# Altium schematic sheet функциональная_схема.SchDoc: Система динамического
size 420 x 297 mm; CheckedBy: Марченко; Author: Пенязьков; DocumentNumber: БГУИР.250504.019Э2; Scale: 1:1; Title2str: освещения; DocumentType: Схема электрическая функциональная; DecimalNumber: Децимальный номер; HeadOfSector: Нач. сектора; MainDevice: Перв.примен.; Name: Наименование; PageSetup: Record=PageOptions|CenterHorizontal=True|CenterVertical=True|PrintScale=0.70|XCorrection=1.00|YCorrection=1.00|PrintKind=1|BorderSize=5000000|LeftOffset=0|BottomOffset=0|Orientation=2|PaperLength=1000|PaperWidth=1000|Scale=100|PaperSource=7|PrintQuality=600|MediaType=1|DitherType=10|PrintScaleMode=1|PaperKind=A4|PaperIndex=9
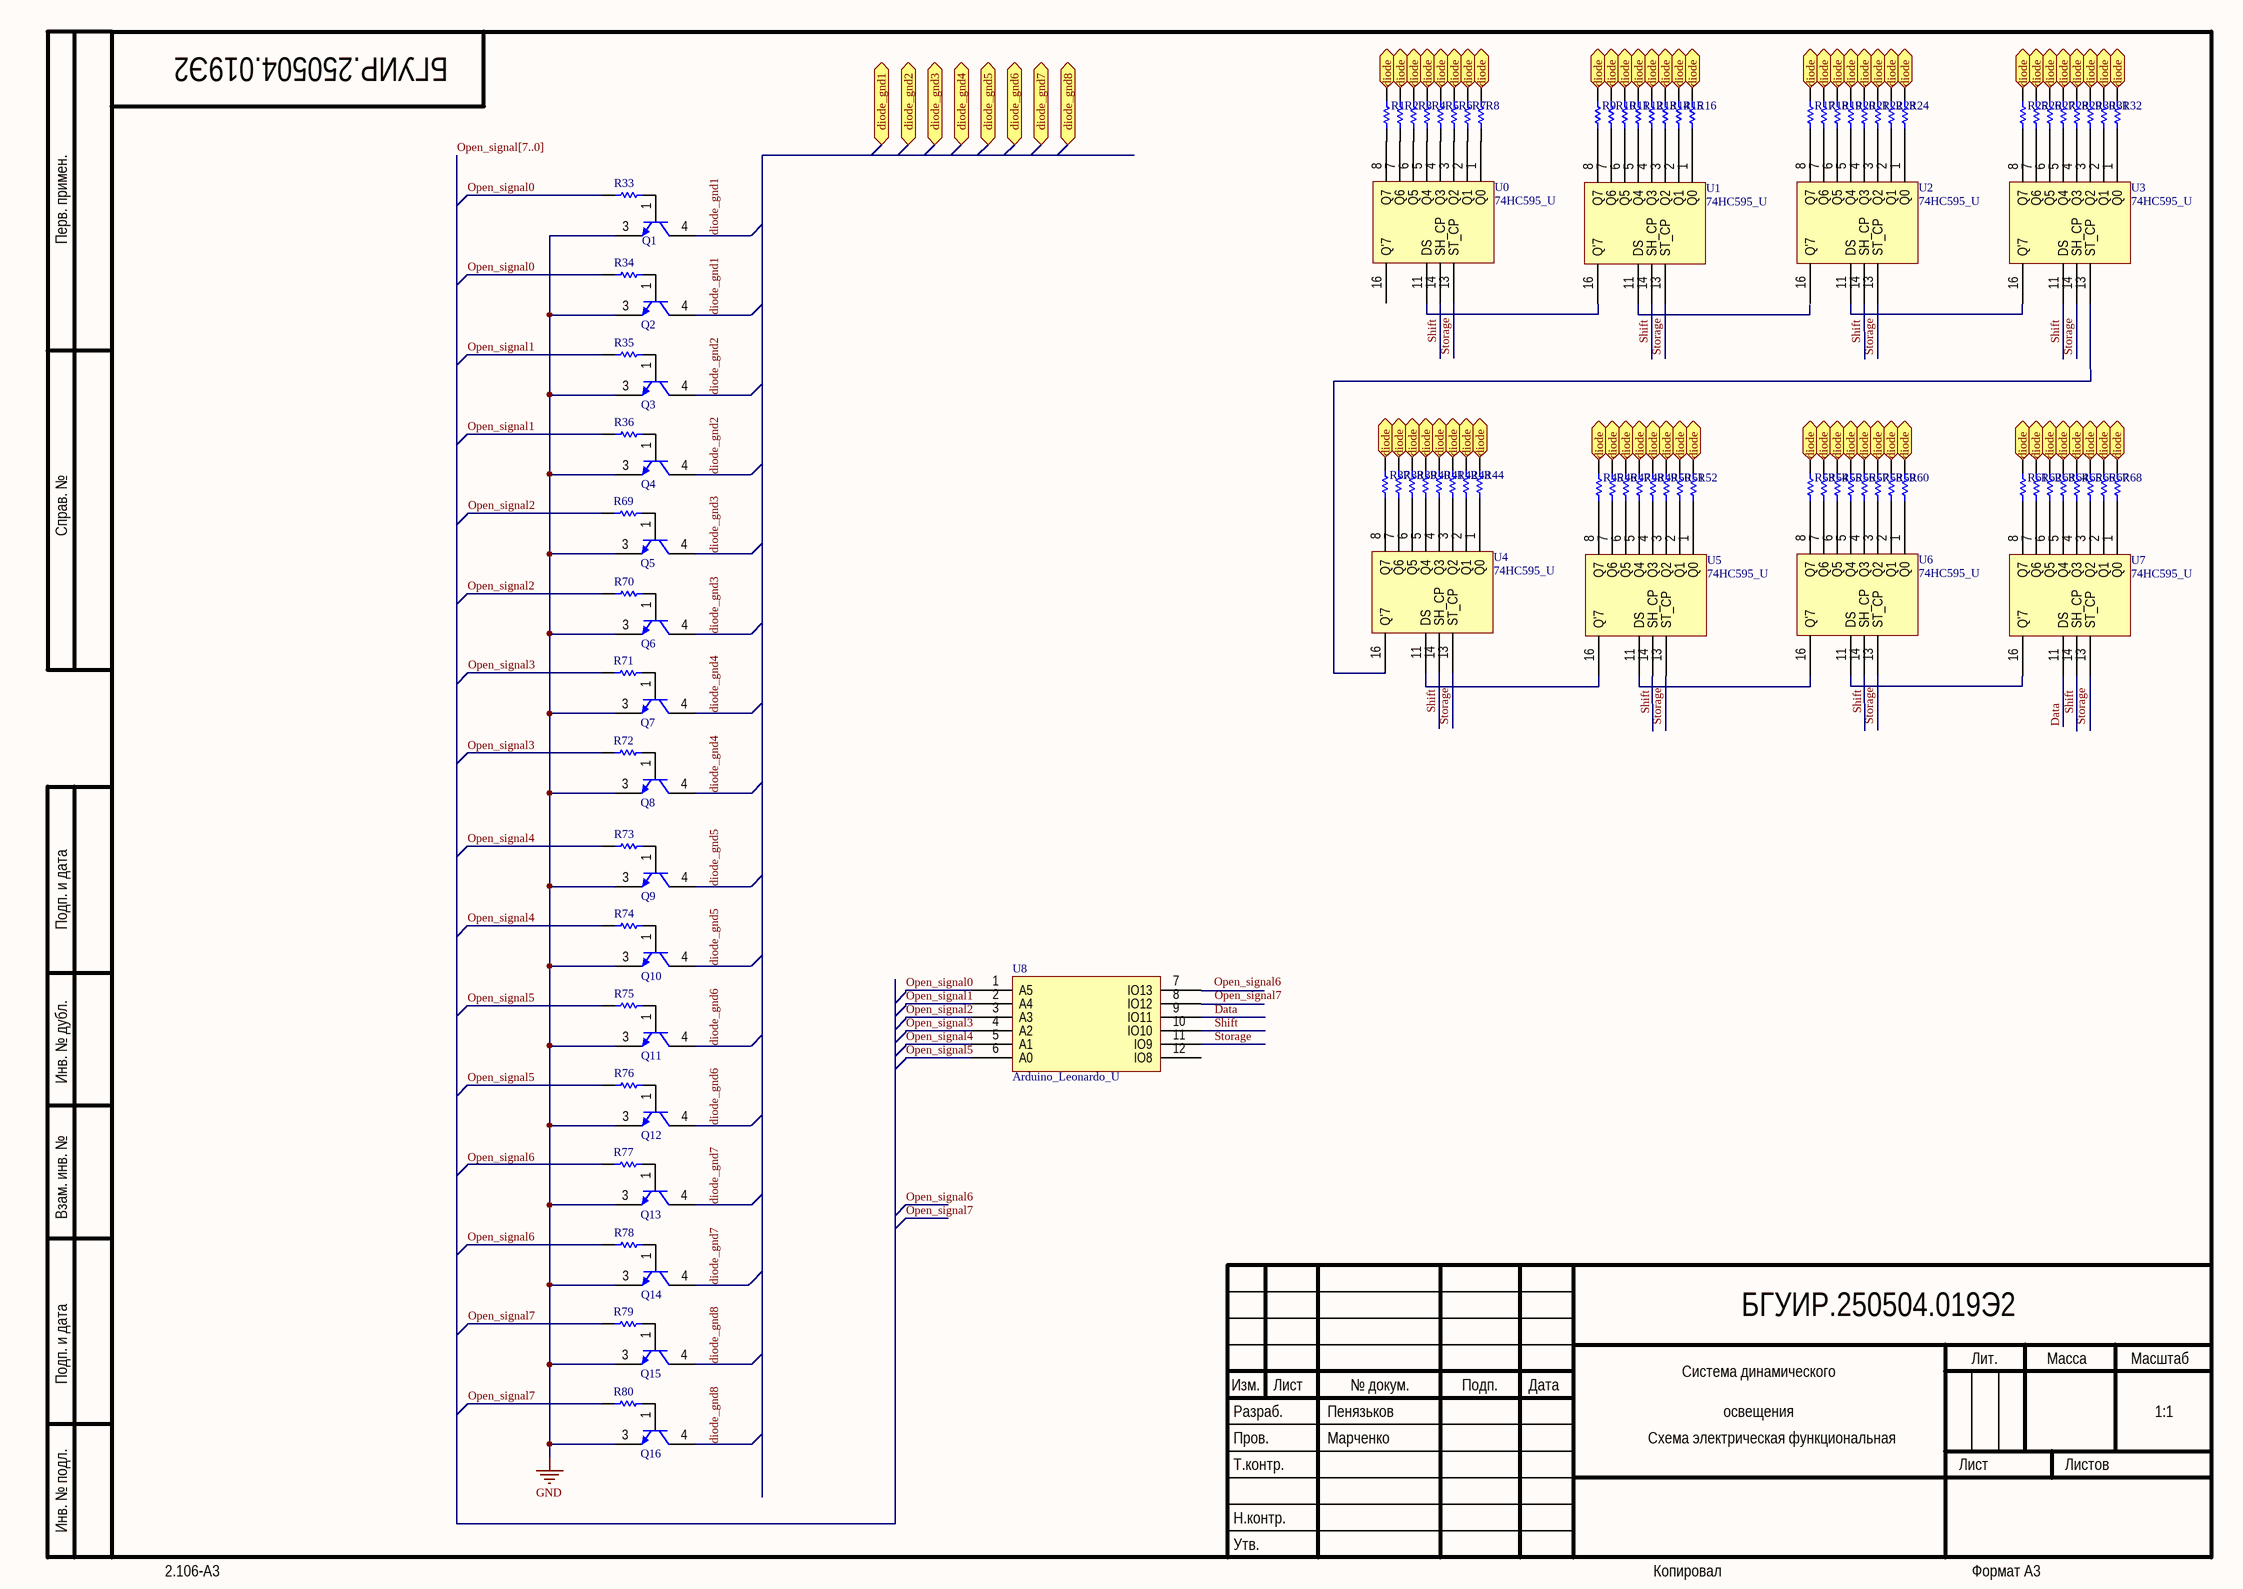
[diagram p0: функциональная_схема.SchDoc]

## Parts
Q1  (no value)  [ONSC-DPAK-3-369C-01_V]
Q2  (no value)  [ONSC-DPAK-3-369C-01_V]
Q3  (no value)  [ONSC-DPAK-3-369C-01_V]
Q4  (no value)  [ONSC-DPAK-3-369C-01_V]
Q5  (no value)  [ONSC-DPAK-3-369C-01_V]
Q6  (no value)  [ONSC-DPAK-3-369C-01_V]
Q7  (no value)  [ONSC-DPAK-3-369C-01_V]
Q8  (no value)  [ONSC-DPAK-3-369C-01_V]
Q9  (no value)  [ONSC-DPAK-3-369C-01_V]
Q10  (no value)  [ONSC-DPAK-3-369C-01_V]
Q11  (no value)  [ONSC-DPAK-3-369C-01_V]
Q12  (no value)  [ONSC-DPAK-3-369C-01_V]
Q13  (no value)  [ONSC-DPAK-3-369C-01_V]
Q14  (no value)  [ONSC-DPAK-3-369C-01_V]
Q15  (no value)  [ONSC-DPAK-3-369C-01_V]
Q16  (no value)  [ONSC-DPAK-3-369C-01_V]
R1  (no value)  [RESC1210(3225)_L]
R2  (no value)  [RESC1210(3225)_L]
R3  (no value)  [RESC1210(3225)_L]
R4  (no value)  [RESC1210(3225)_L]
R5  (no value)  [RESC1210(3225)_L]
R6  (no value)  [RESC1210(3225)_L]
R7  (no value)  [RESC1210(3225)_L]
R8  (no value)  [RESC1210(3225)_L]
R9  (no value)  [RESC1210(3225)_L]
R10  (no value)  [RESC1210(3225)_L]
R11  (no value)  [RESC1210(3225)_L]
R12  (no value)  [RESC1210(3225)_L]
R13  (no value)  [RESC1210(3225)_L]
R14  (no value)  [RESC1210(3225)_L]
R15  (no value)  [RESC1210(3225)_L]
R16  (no value)  [RESC1210(3225)_L]
R17  (no value)  [RESC1210(3225)_L]
R18  (no value)  [RESC1210(3225)_L]
R19  (no value)  [RESC1210(3225)_L]
R20  (no value)  [RESC1210(3225)_L]
R21  (no value)  [RESC1210(3225)_L]
R22  (no value)  [RESC1210(3225)_L]
R23  (no value)  [RESC1210(3225)_L]
R24  (no value)  [RESC1210(3225)_L]
R25  (no value)  [RESC1210(3225)_L]
R26  (no value)  [RESC1210(3225)_L]
R27  (no value)  [RESC1210(3225)_L]
R28  (no value)  [RESC1210(3225)_L]
R29  (no value)  [RESC1210(3225)_L]
R30  (no value)  [RESC1210(3225)_L]
R31  (no value)  [RESC1210(3225)_L]
R32  (no value)  [RESC1210(3225)_L]
R33  (no value)  [RESC1210(3225)_L]
R34  (no value)  [RESC1210(3225)_L]
R35  (no value)  [RESC1210(3225)_L]
R36  (no value)  [RESC1210(3225)_L]
R37  (no value)  [RESC1210(3225)_L]
R38  (no value)  [RESC1210(3225)_L]
R39  (no value)  [RESC1210(3225)_L]
R40  (no value)  [RESC1210(3225)_L]
R41  (no value)  [RESC1210(3225)_L]
R42  (no value)  [RESC1210(3225)_L]
R43  (no value)  [RESC1210(3225)_L]
R44  (no value)  [RESC1210(3225)_L]
R45  (no value)  [RESC1210(3225)_L]
R46  (no value)  [RESC1210(3225)_L]
R47  (no value)  [RESC1210(3225)_L]
R48  (no value)  [RESC1210(3225)_L]
R49  (no value)  [RESC1210(3225)_L]
R50  (no value)  [RESC1210(3225)_L]
R51  (no value)  [RESC1210(3225)_L]
R52  (no value)  [RESC1210(3225)_L]
R53  (no value)  [RESC1210(3225)_L]
R54  (no value)  [RESC1210(3225)_L]
R55  (no value)  [RESC1210(3225)_L]
R56  (no value)  [RESC1210(3225)_L]
R57  (no value)  [RESC1210(3225)_L]
R58  (no value)  [RESC1210(3225)_L]
R59  (no value)  [RESC1210(3225)_L]
R60  (no value)  [RESC1210(3225)_L]
R61  (no value)  [RESC1210(3225)_L]
R62  (no value)  [RESC1210(3225)_L]
R63  (no value)  [RESC1210(3225)_L]
R64  (no value)  [RESC1210(3225)_L]
R65  (no value)  [RESC1210(3225)_L]
R66  (no value)  [RESC1210(3225)_L]
R67  (no value)  [RESC1210(3225)_L]
R68  (no value)  [RESC1210(3225)_L]
R69  (no value)  [RESC1210(3225)_L]
R70  (no value)  [RESC1210(3225)_L]
R71  (no value)  [RESC1210(3225)_L]
R72  (no value)  [RESC1210(3225)_L]
R73  (no value)  [RESC1210(3225)_L]
R74  (no value)  [RESC1210(3225)_L]
R75  (no value)  [RESC1210(3225)_L]
R76  (no value)  [RESC1210(3225)_L]
R77  (no value)  [RESC1210(3225)_L]
R78  (no value)  [RESC1210(3225)_L]
R79  (no value)  [RESC1210(3225)_L]
R80  (no value)  [RESC1210(3225)_L]
U0  74HC595_U
U1  74HC595_U
U2  74HC595_U
U3  74HC595_U
U4  74HC595_U
U5  74HC595_U
U6  74HC595_U
U7  74HC595_U
U8  Arduino_Leonardo_U

## Ports
diode, diode_gnd1, diode_gnd2, diode_gnd3, diode_gnd4, diode_gnd5, diode_gnd6, diode_gnd7, diode_gnd8

## Nets
GND: Q1.3(E) Q2.3(E) Q3.3(E) Q4.3(E) Q5.3(E) Q6.3(E) Q7.3(E) Q8.3(E) Q9.3(E) Q10.3(E) Q11.3(E) Q12.3(E) Q13.3(E) Q14.3(E) Q15.3(E) Q16.3(E)
Data: U8.9(IO11)
diode: R1.2 R2.2 R3.2 R4.2 R5.2 R6.2 R7.2 R8.2 R9.2 R10.2 R11.2 R12.2 R13.2 R14.2 R15.2 R16.2 R17.2 R18.2 R19.2 R20.2 R21.2 R22.2 R23.2 R24.2 R25.2 R26.2 R27.2 R28.2 R29.2 R30.2 R31.2 R32.2 R37.2 R38.2 R39.2 R40.2 R41.2 R42.2 R43.2 R44.2 R45.2 R46.2 R47.2 R48.2 R49.2 R50.2 R51.2 R52.2 R53.2 R54.2 R55.2 R56.2 R57.2 R58.2 R59.2 R60.2 R61.2 R62.2 R63.2 R64.2 R65.2 R66.2 R67.2 R68.2 ; port diode
diode_gnd1: Q1.4(C) Q2.4(C)
diode_gnd2: Q3.4(C) Q4.4(C)
diode_gnd3: Q5.4(C) Q6.4(C)
diode_gnd4: Q7.4(C) Q8.4(C)
diode_gnd5: Q9.4(C) Q10.4(C)
diode_gnd6: Q11.4(C) Q12.4(C)
diode_gnd7: Q13.4(C) Q14.4(C)
diode_gnd8: Q15.4(C) Q16.4(C)
Open_signal0: R33.2 R34.2 U8.1(A5)
Open_signal1: R35.2 R36.2 U8.2(A4)
Open_signal2: R69.2 R70.2 U8.3(A3)
Open_signal3: R71.2 R72.2 U8.4(A2)
Open_signal4: R73.2 R74.2 U8.5(A1)
Open_signal5: R75.2 R76.2 U8.6(A0)
Open_signal6: R77.2 R78.2
Open_signal7: R79.2 R80.2
Shift: U0.14(SH_CP) U1.14(SH_CP) U3.11(DS) U4.14(SH_CP) U8.10(IO10)
Storage: U0.13(ST_CP) U1.13(ST_CP) U3.14(SH_CP) U4.13(ST_CP) U8.11(IO9)
NetQ1_1: Q1.1(B) R33.1
NetQ2_1: Q2.1(B) R34.1
NetQ3_1: Q3.1(B) R35.1
NetQ4_1: Q4.1(B) R36.1
NetQ5_1: Q5.1(B) R69.1
NetQ6_1: Q6.1(B) R70.1
NetQ7_1: Q7.1(B) R71.1
NetQ8_1: Q8.1(B) R72.1
NetQ9_1: Q9.1(B) R73.1
NetQ10_1: Q10.1(B) R74.1
NetQ11_1: Q11.1(B) R75.1
NetQ12_1: Q12.1(B) R76.1
NetQ13_1: Q13.1(B) R77.1
NetQ14_1: Q14.1(B) R78.1
NetQ15_1: Q15.1(B) R79.1
NetQ16_1: Q16.1(B) R80.1
NetR9_1: R9.1 U1.8(Q7)
NetR10_1: R10.1 U1.7(Q6)
NetR11_1: R11.1 U1.6(Q5)
NetR12_1: R12.1 U1.5(Q4)
NetR13_1: R13.1 U1.4(Q3)
NetR14_1: R14.1 U1.3(Q2)
NetR15_1: R15.1 U1.2(Q1)
NetR16_1: R16.1 U1.1(Q0)
NetR17_1: R17.1 U2.8(Q7)
NetR18_1: R18.1 U2.7(Q6)
NetR19_1: R19.1 U2.6(Q5)
NetR20_1: R20.1 U2.5(Q4)
NetR21_1: R21.1 U2.4(Q3)
NetR22_1: R22.1 U2.3(Q2)
NetR23_1: R23.1 U2.2(Q1)
NetR24_1: R24.1 U2.1(Q0)
NetR25_1: R25.1 U3.8(Q7)
NetR26_1: R26.1 U3.7(Q6)
NetR27_1: R27.1 U3.6(Q5)
NetR28_1: R28.1 U3.5(Q4)
NetR29_1: R29.1 U3.4(Q3)
NetR30_1: R30.1 U3.3(Q2)
NetR31_1: R31.1 U3.2(Q1)
NetR32_1: R32.1 U3.1(Q0)
NetR37_1: R37.1 U4.8(Q7)
NetR38_1: R38.1 U4.7(Q6)
NetR39_1: R39.1 U4.6(Q5)
NetR40_1: R40.1 U4.5(Q4)
NetR41_1: R41.1 U4.4(Q3)
NetR42_1: R42.1 U4.3(Q2)
NetR43_1: R43.1 U4.2(Q1)
NetR44_1: R44.1 U4.1(Q0)
NetR45_1: R45.1 U5.8(Q7)
NetR46_1: R46.1 U5.7(Q6)
NetR47_1: R47.1 U5.6(Q5)
NetR48_1: R48.1 U5.5(Q4)
NetR49_1: R49.1 U5.4(Q3)
NetR50_1: R50.1 U5.3(Q2)
NetR51_1: R51.1 U5.2(Q1)
NetR52_1: R52.1 U5.1(Q0)
NetR53_1: R53.1 U6.8(Q7)
NetR54_1: R54.1 U6.7(Q6)
NetR55_1: R55.1 U6.6(Q5)
NetR56_1: R56.1 U6.5(Q4)
NetR57_1: R57.1 U6.4(Q3)
NetR58_1: R58.1 U6.3(Q2)
NetR59_1: R59.1 U6.2(Q1)
NetR60_1: R60.1 U6.1(Q0)
NetR61_1: R61.1 U7.8(Q7)
NetR62_1: R62.1 U7.7(Q6)
NetR63_1: R63.1 U7.6(Q5)
NetR64_1: R64.1 U7.5(Q4)
NetR65_1: R65.1 U7.4(Q3)
NetR66_1: R66.1 U7.3(Q2)
NetR67_1: R67.1 U7.2(Q1)
NetR68_1: R68.1 U7.1(Q0)
NetU0_11: U0.11(DS) U1.16(Q'7)
NetU2_11: U2.11(DS) U3.16(Q'7)
NetU3_13: U3.13(ST_CP) U4.16(Q'7)
NetU4_11: U4.11(DS) U5.16(Q'7)
NetU5_11: U5.11(DS) U5.13(ST_CP) U6.16(Q'7)
NetU6_11: U6.11(DS) U7.16(Q'7)

Not connected (* = marked no-connect by the designer): R1 1; R2 1; R3 1; R4 1; R5 1; R6 1; R7 1; R8 1; U0 1(Q0) 2(Q1) 3(Q2) 4(Q3) 5(Q4) 6(Q5) 7(Q6) 8(Q7) 16(Q'7); U1 11(DS); U2 13(ST_CP) 14(SH_CP) 16(Q'7); U5 14(SH_CP); U6 13(ST_CP) 14(SH_CP); U7 11(DS) 13(ST_CP) 14(SH_CP); U8 7(IO13) 8(IO12) 12(IO8)

## Buses and harness runs
bus Open_signal[7..0]

## Notes on the sheet
- Labels drawn without touching a wire or pin: Open_signal6, Open_signal7, Shift, Storage
- Перв. примен.
- Справ. №
- Подп. и дата
- Инв. № дубл.
- Взам. инв. №
- Разраб.
- Изм.
- Лист
- № докум.
- Подп.
- Дата
- Лит.
- Масса
- Масштаб
- Пров.
- Т.контр.
- Листов
- Инв. № подл.
- Утв.
- Н.контр.
- 2.106-A3
- Копировал
- Формат А3

## Library data of the parts
Q1-Q16 = CMP-1030-00002-1: Complementary Power Transistor, 3-Pin DPAK, Pb-Free, Tube; PartNumber: NJVMJD44H11G; Manufacturer: On Semiconductor; Polarity: NPN; IC Continuous (A): 8; Mounting Technology: Surface Mount; ComponentLink2Description: Datasheet; ComponentLink3Description: Package Specification; DatasheetVersion: Rev. 16; ComponentLink2URL: http://www.onsemi.cn/pub_link/Collateral/MJD44H11-D.PDF; Packing: Tube; PackageVersion: Rev. E, 02/2014; RoHS: TRUE; ComponentLink3URL: http://www.onsemi.cn/pub_link/Collateral/369C.PDF; PackageReference: DPAK-3-369C-01; ComponentLink1Description: Manufacturer URL; PackageDescription: 3-Pin Flange Mount, Body 6.54 x 6.095 mm, Pitch 2.29 mm; ComponentLink1URL: http://www.onsemi.com/
R1-R80 = CMP-1015-00050-1: 100R 0.5W 5% 1210 (3225 Metric)  SMD; Value: 100.00 Ohm; Case-Metric: 3225; Case-EIA: 1210; Power: 0.5 W; Tolerance: 5 %; Technology: SMT